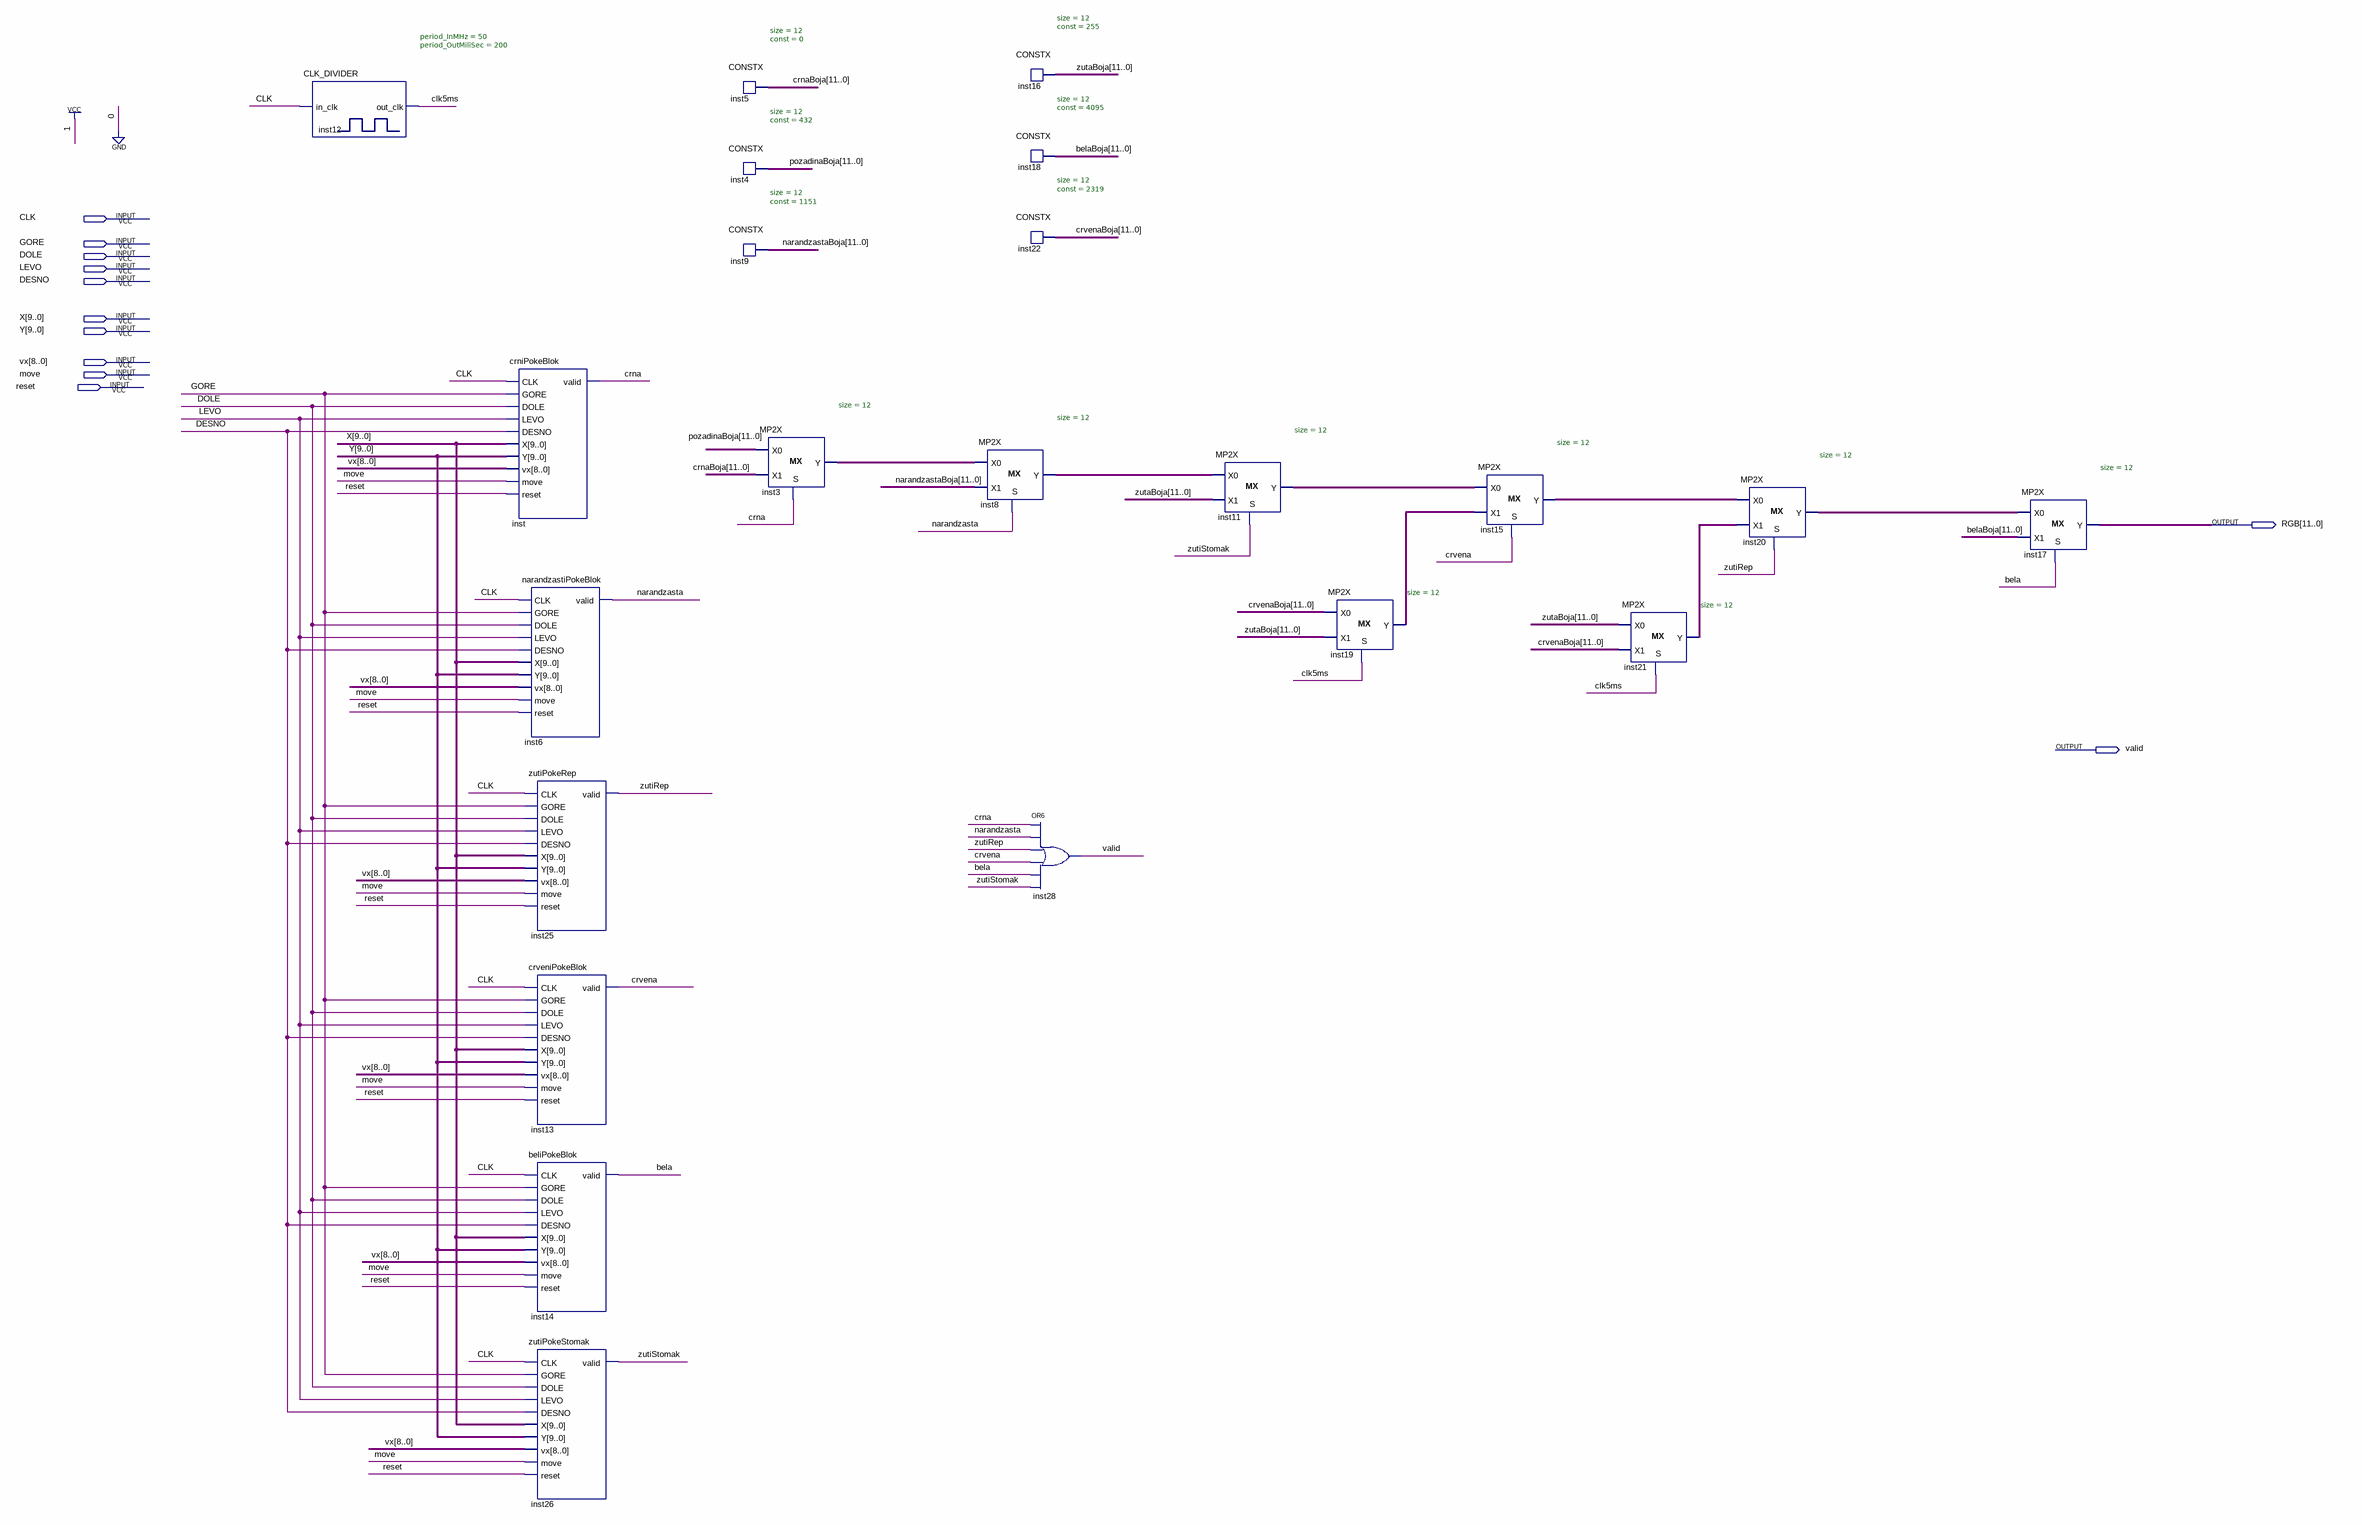
[diagram p0: schematic sheet]
// Quartus schematic carmander.bdf as structural Verilog: 22 symbols, 12 pins
module carmander (
  input  CLK,
  input  GORE,
  input  DOLE,
  input  LEVO,
  input  DESNO,
  input  [9:0] X,
  input  [9:0] Y,
  input  [8:0] vx,
  input  move,
  input  reset,
  output [11:0] RGB,
  output valid
);

  wire bela, clk5ms, crna, crvena, narandzasta, zutiRep, zutiStomak;
  wire [11:0] belaBoja, crnaBoja, crvenaBoja, inst3_y, inst8_y, inst11_y, inst15_y, inst19_y, inst20_y,
       inst21_y, narandzastaBoja, pozadinaBoja, zutaBoja;

  CLK_DIVIDER #(.period_InMHz(50), .period_OutMiliSec(200)) inst12 (.in_clk(CLK), .out_clk(clk5ms));
  crniPokeBlok inst (
    .CLK(CLK), .GORE(GORE), .DOLE(DOLE), .LEVO(LEVO), .DESNO(DESNO), .X(X), .Y(Y), .vx(vx), .move(move),
    .reset(reset), .valid(crna));
  narandzastiPokeBlok inst6 (
    .CLK(CLK), .GORE(GORE), .DOLE(DOLE), .LEVO(LEVO), .DESNO(DESNO), .X(X), .Y(Y), .vx(vx), .move(move),
    .reset(reset), .valid(narandzasta));
  zutiPokeRep inst25 (
    .CLK(CLK), .GORE(GORE), .DOLE(DOLE), .LEVO(LEVO), .DESNO(DESNO), .X(X), .Y(Y), .vx(vx), .move(move),
    .reset(reset), .valid(zutiRep));
  crveniPokeBlok inst13 (
    .CLK(CLK), .GORE(GORE), .DOLE(DOLE), .LEVO(LEVO), .DESNO(DESNO), .X(X), .Y(Y), .vx(vx), .move(move),
    .reset(reset), .valid(crvena));
  beliPokeBlok inst14 (
    .CLK(CLK), .GORE(GORE), .DOLE(DOLE), .LEVO(LEVO), .DESNO(DESNO), .X(X), .Y(Y), .vx(vx), .move(move),
    .reset(reset), .valid(bela));
  zutiPokeStomak inst26 (
    .CLK(CLK), .GORE(GORE), .DOLE(DOLE), .LEVO(LEVO), .DESNO(DESNO), .X(X), .Y(Y), .vx(vx), .move(move),
    .reset(reset), .valid(zutiStomak));
  CONSTX #(.size(12), .\const (0)) inst5 (.data(crnaBoja));
  CONSTX #(.size(12), .\const (432)) inst4 (.data(pozadinaBoja));
  CONSTX #(.size(12), .\const (1151)) inst9 (.data(narandzastaBoja));
  MP2X #(.size(12)) inst3 (.S(crna), .X0(pozadinaBoja), .X1(crnaBoja), .Y(inst3_y));
  CONSTX #(.size(12), .\const (255)) inst16 (.data(zutaBoja));
  CONSTX #(.size(12), .\const (4095)) inst18 (.data(belaBoja));
  CONSTX #(.size(12), .\const (2319)) inst22 (.data(crvenaBoja));
  MP2X #(.size(12)) inst8 (.S(narandzasta), .X0(inst3_y), .X1(narandzastaBoja), .Y(inst8_y));
  or inst28 (valid, crna, narandzasta, zutiRep, crvena, bela, zutiStomak);
  MP2X #(.size(12)) inst11 (.S(zutiStomak), .X0(inst8_y), .X1(zutaBoja), .Y(inst11_y));
  MP2X #(.size(12)) inst19 (.S(clk5ms), .X0(crvenaBoja), .X1(zutaBoja), .Y(inst19_y));
  MP2X #(.size(12)) inst15 (.S(crvena), .X0(inst11_y), .X1(inst19_y), .Y(inst15_y));
  MP2X #(.size(12)) inst21 (.S(clk5ms), .X0(zutaBoja), .X1(crvenaBoja), .Y(inst21_y));
  MP2X #(.size(12)) inst20 (.S(zutiRep), .X0(inst15_y), .X1(inst21_y), .Y(inst20_y));
  MP2X #(.size(12)) inst17 (.S(bela), .X0(inst20_y), .X1(belaBoja), .Y(RGB));
endmodule
